# Altium schematic sheet Controller2.SchDoc
size A3
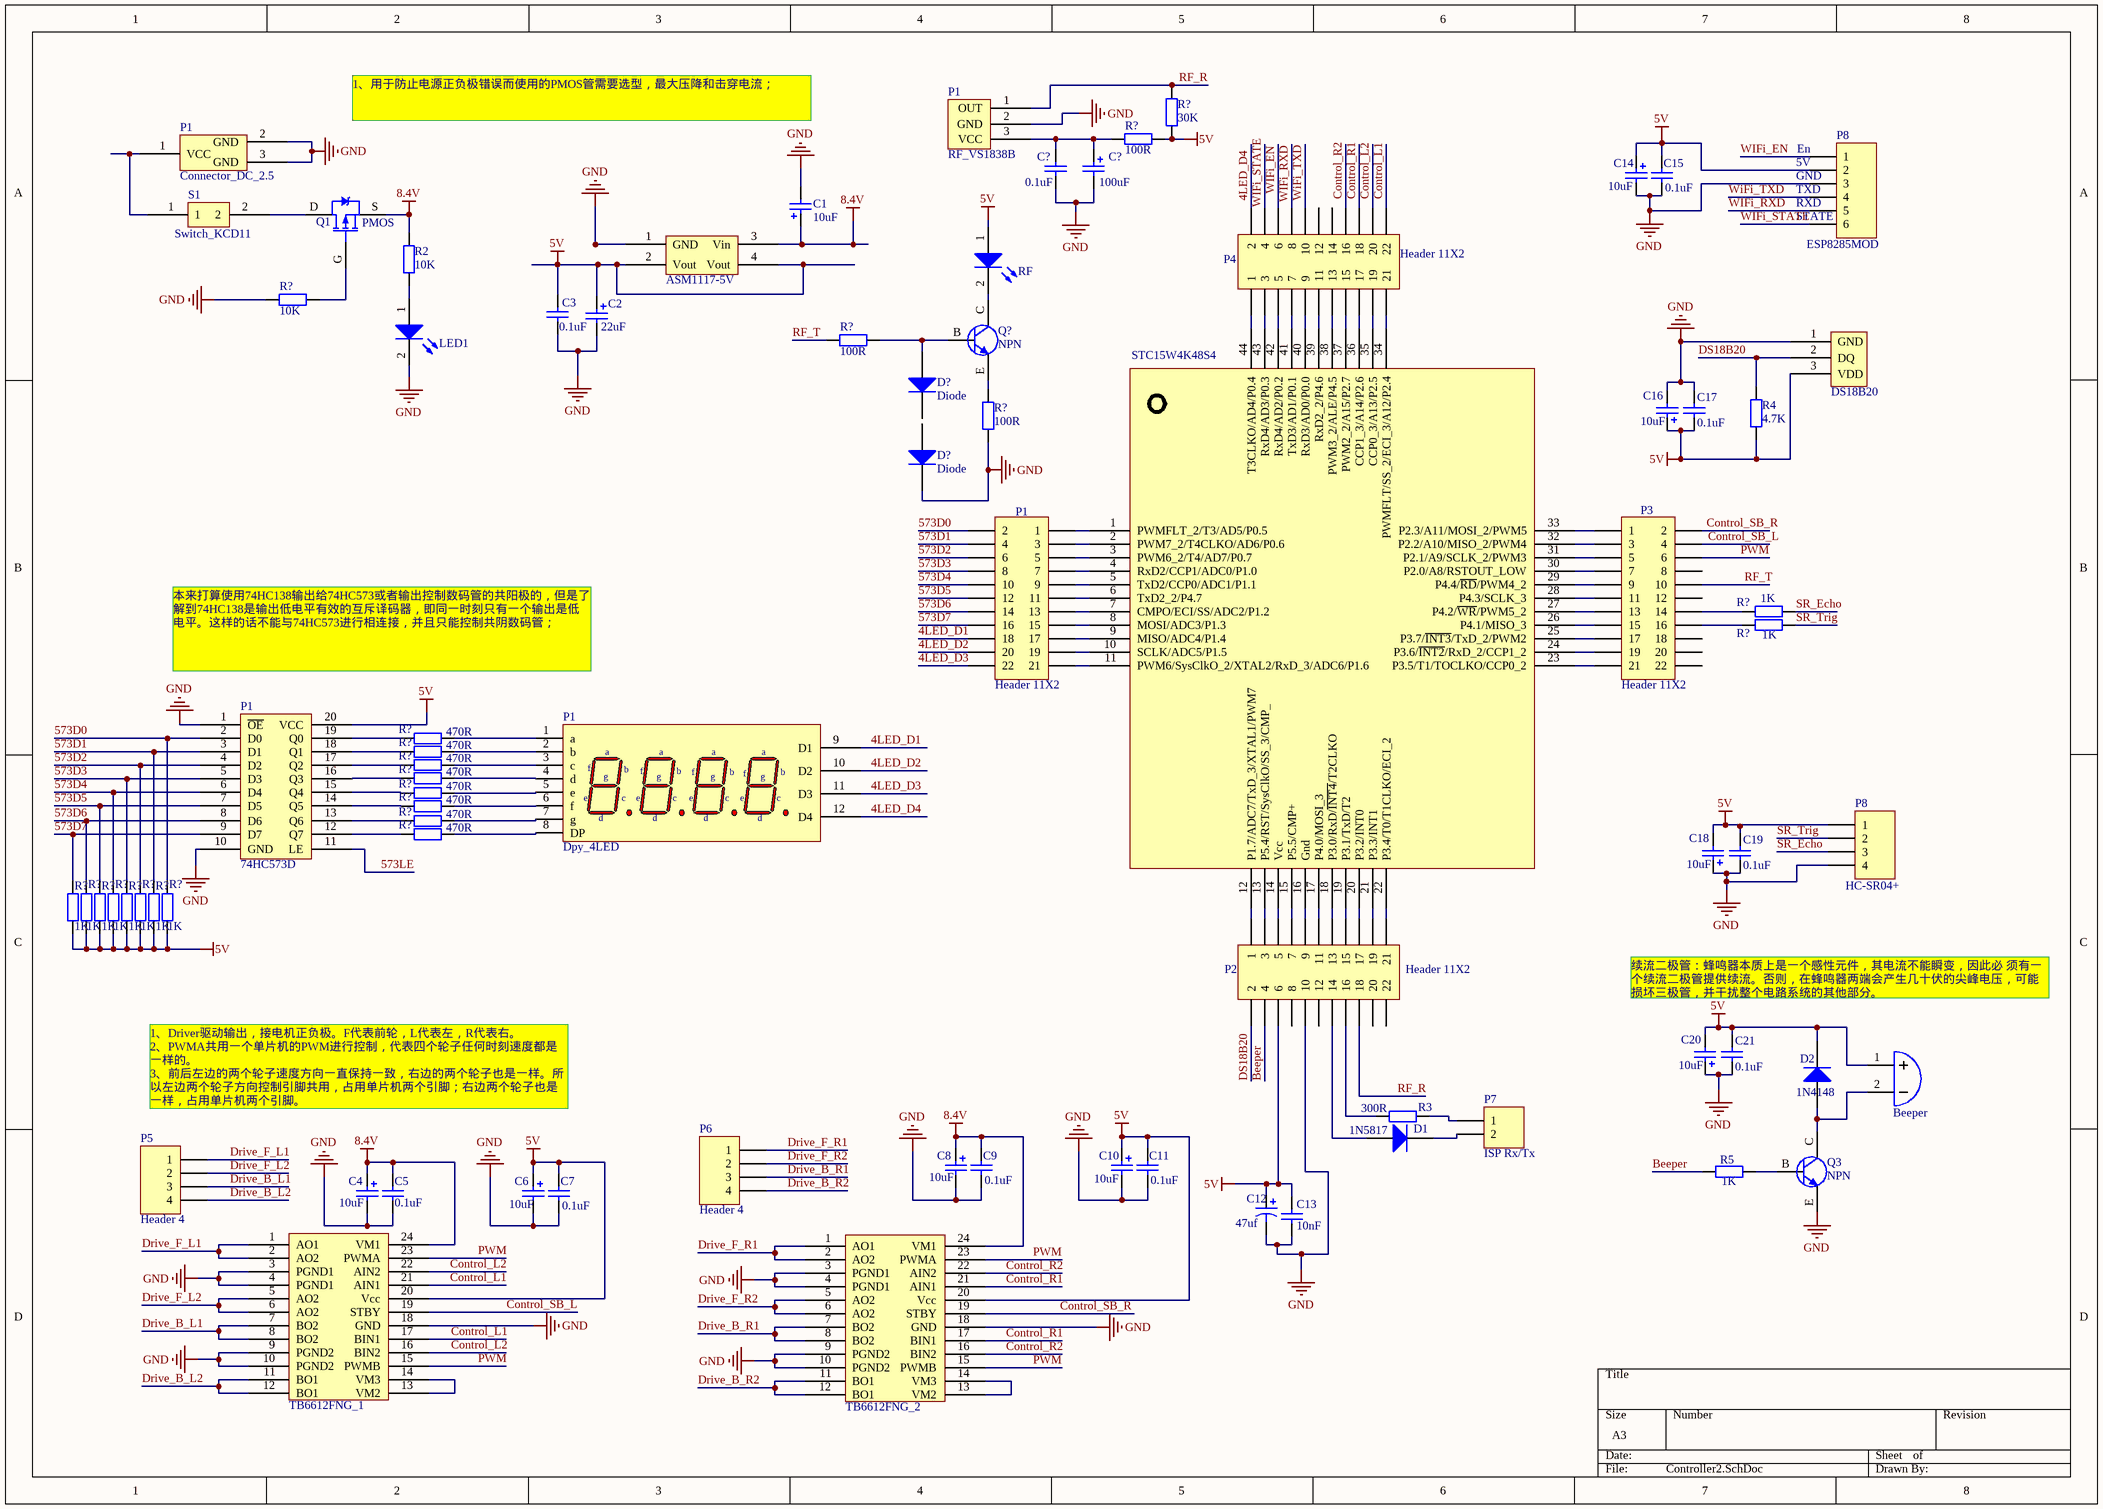
[diagram p0: Controller2.SchDoc]

## Parts
(Parts that share a designator on the sheet are numbered #1, #2 ... from top to bottom, then left to right.)
*  STC15W4K48S4  [STC15W4K48S4_LQFP44]
ASM1117-5V  ASM1117-5V  [SOT-223]  (value not drawn)
Beeper  Beeper  [Buzzer-2Pins]  (value not drawn)
C1  value 10uF  [C1206-Pole]  (hidden comment: Cap_Pole)
C2  value 22uF  [C1206-Pole]  (hidden comment: Cap_Pole)
C3  value 0.1uF  [C0603]  (hidden comment: Cap)
C4  10uF  [C1206-Pole]
C5  0.1uF  [C0603]
C6  10uF  [C1206-Pole]
C7  0.1uF  [C0603]
C8  10uF  [C1206-Pole]
C9  0.1uF  [C0603]
C10  10uF  [C1206-Pole]
C11  0.1uF  [C0603]
C12  value 47uf  [RB7.6-15]  (hidden comment: Cap Pol1)
C13  value 10nF  [RAD-0.3]  (hidden comment: Cap)
C14  10uF  [C1206-Pole]
C15  0.1uF  [C0603]
C16  10uF  [C1206-Pole]
C17  0.1uF  [C0603]
C18  10uF  [C1206-Pole]
C19  0.1uF  [C0603]
C20  10uF  [C1206-Pole]
C21  0.1uF  [C0603]
C?#1  value 0.1uF  [C0603]  (hidden comment: Cap)
C?#2  value 100uF  [C1206-Pole]  (hidden comment: Cap_Pole)
D1  1N5817  [DO-35]
D2  1N4148  [SMA/DO-214AC]
D?#1  Diode  [SMA/DO-214AC]
D?#2  Diode  [SMA/DO-214AC]
DS18B20  DS18B20  [TO-92]  (value not drawn)
LED1  LED-0805  [LED-0805]  (value not drawn)
P1#1  RF_VS1838B  [RF_VS1838B]
P1#2  Connector_DC_2.5  [Connector_DC_2.5]
P1#3  Header 11X2  [HDR2X11]
P1#4  74HC573D  [74HC573D_SOP]
P1#5  Dpy_4LED  [Dpy_LED4_Power]
P2  Header 11X2  [HDR2X11]
P3  Header 11X2  [HDR2X11]
P4  Header 11X2  [HDR2X11]
P5  Header 4  [HDR1X4]
P6  Header 4  [HDR1X4]
P7  ISP Rx/Tx  [HDR1X2]
P8#1  ESP8285MOD  [HDR1X6]
P8#2  HC-SR04+  [HDR1X4]
Q1  PMOS  [SOT-23/MOS]
Q3  NPN  [SOT-23/transistor]
Q?  NPN  [SOT-23/transistor]
R2  10K  [R0603]
R3  value 300R  [AXIAL-0.4]  (hidden comment: Res2)
R4  4.7K  [R0603]
R5  1K  [R0603]
R?#1  100R  [R0603]
R?#2  30K  [R0603]
R?#3  10K  [R0603]
R?#4  100R  [R0603]
R?#5  100R  [R0603]
R?#6  1K  [R0603]
R?#7  1K  [R0603]
R?#8  470R  [R0603]
R?#9  470R  [R0603]
R?#10  470R  [R0603]
R?#11  470R  [R0603]
R?#12  470R  [R0603]
R?#13  470R  [R0603]
R?#14  470R  [R0603]
R?#15  470R  [R0603]
R?#16  1K  [R0603]
R?#17  1K  [R0603]
R?#18  1K  [R0603]
R?#19  1K  [R0603]
R?#20  1K  [R0603]
R?#21  1K  [R0603]
R?#22  1K  [R0603]
R?#23  1K  [R0603]
RF  LED-0805  [LED-0805]  (value not drawn)
S1  Switch_KCD11  [Switch_KCD11]
TB6612FNG_1  TB6612FNG  [ssop24]  (value not drawn)
TB6612FNG_2  TB6612FNG  [ssop24]  (value not drawn)

## Nets
5V: ASM1117-5V.2(Vout) ASM1117-5V.4(Vout) Beeper.1(A) C2.1 C3.1 C6.1 C7.1 C10.1 C11.1 C12.1 C13.2 C16.1 C17.2 C18.2 C19.1 C20.2 C21.1 D2.2 DS18B20.3(VDD) P1#4.20(VCC) P2.6 P8#2.1 R4.1 R?#1.1 R?#2.2 R?#16.1 R?#17.1 R?#18.1 R?#19.1 R?#20.1 R?#21.1 R?#22.1 R?#23.1 RF.1(A) TB6612FNG_1.20(Vcc) TB6612FNG_2.20(Vcc)
8.4V: ASM1117-5V.3(Vin) C1.1 C4.1 C5.1 C8.1 C9.1 Q1.S R2.1 TB6612FNG_1.24(VM1) TB6612FNG_2.24(VM1)
GND: ASM1117-5V.1(GND) C1.2 C2.2 C3.2 C4.2 C5.2 C6.2 C7.2 C8.2 C9.2 C10.2 C11.2 C12.2 C13.1 C14.2 C15.2 C16.2 C17.1 C18.1 C19.2 C20.1 C21.2 C?#1.2 C?#2.2 D?#2.2 DS18B20.1(GND) LED1.2(K) P1#1.2(GND) P1#2.2(GND) P1#2.3(GND) P1#4.1(~{OE}) P1#4.10(GND) P2.10 P8#1.3 P8#2.4 Q3.E R?#3.1 R?#5.2 TB6612FNG_1.3(PGND1) TB6612FNG_1.4(PGND1) TB6612FNG_1.9(PGND2) TB6612FNG_1.10(PGND2) TB6612FNG_1.18(GND) TB6612FNG_2.3(PGND1) TB6612FNG_2.4(PGND1) TB6612FNG_2.9(PGND2) TB6612FNG_2.10(PGND2) TB6612FNG_2.18(GND)
4LED_D1: P1#3.18 P1#5.9(D1)
4LED_D2: P1#3.20 P1#5.10(D2)
4LED_D3: P1#3.22 P1#5.11(D3)
4LED_D4: P1#5.12(D4) P4.2
573D0: P1#3.2 P1#4.2(D0) R?#23.2
573D1: P1#3.4 P1#4.3(D1) R?#22.2
573D2: P1#3.6 P1#4.4(D2) R?#21.2
573D3: P1#3.8 P1#4.5(D3) R?#20.2
573D4: P1#3.10 P1#4.6(D4) R?#19.2
573D5: P1#3.12 P1#4.7(D5) R?#18.2
573D6: P1#3.14 P1#4.8(D6) R?#17.2
573D7: P1#3.16 P1#4.9(D7) R?#16.2
573LE: P1#4.11(LE)
Beeper: P2.4 R5.1
Control_L1: P4.22 TB6612FNG_1.17(BIN1) TB6612FNG_1.21(AIN1)
Control_L2: P4.20 TB6612FNG_1.16(BIN2) TB6612FNG_1.22(AIN2)
Control_R1: P4.18 TB6612FNG_2.17(BIN1) TB6612FNG_2.21(AIN1)
Control_R2: P4.16 TB6612FNG_2.16(BIN2) TB6612FNG_2.22(AIN2)
Control_SB_L: P3.4 TB6612FNG_1.19(STBY)
Control_SB_R: P3.2 TB6612FNG_2.19(STBY)
Drive_B_L1: P5.3 TB6612FNG_1.7(BO2) TB6612FNG_1.8(BO2)
Drive_B_L2: P5.4 TB6612FNG_1.11(BO1) TB6612FNG_1.12(BO1)
Drive_B_R1: P6.3 TB6612FNG_2.7(BO2) TB6612FNG_2.8(BO2)
Drive_B_R2: P6.4 TB6612FNG_2.11(BO1) TB6612FNG_2.12(BO1)
Drive_F_L1: P5.1 TB6612FNG_1.1(AO1) TB6612FNG_1.2(AO2)
Drive_F_L2: P5.2 TB6612FNG_1.5(AO2) TB6612FNG_1.6(AO2)
Drive_F_R1: P6.1 TB6612FNG_2.1(AO1) TB6612FNG_2.2(AO2)
Drive_F_R2: P6.2 TB6612FNG_2.5(AO2) TB6612FNG_2.6(AO2)
DS18B20: DS18B20.2(DQ) P2.2 R4.2
PWM: P3.6 TB6612FNG_1.15(PWMB) TB6612FNG_1.23(PWMA) TB6612FNG_2.15(PWMB) TB6612FNG_2.23(PWMA)
RF_R: P1#1.1(OUT) P2.18 R?#2.1
RF_T: P3.10 R?#4.2
SR_Echo: P8#2.3 R?#6.2
SR_Trig: P8#2.2 R?#7.2
WIFi_EN: P4.6 P8#1.1
WIFi_RXD: P4.8 P8#1.5
WIFi_STATE: P4.4 P8#1.6
WiFi_TXD: P4.10 P8#1.4
Net*_1: *.1(PWMFLT_2/T3/AD5/P0.5) P1#3.1
Net*_2: *.2(PWM7_2/T4CLKO/AD6/P0.6) P1#3.3
Net*_3: *.3(PWM6_2/T4/AD7/P0.7) P1#3.5
Net*_4: *.4(RxD2/CCP1/ADC0/P1.0) P1#3.7
Net*_5: *.5(TxD2/CCP0/ADC1/P1.1) P1#3.9
Net*_6: *.6(TxD2_2/P4.7) P1#3.11
Net*_7: *.7(CMPO/ECI/SS/ADC2/P1.2) P1#3.13
Net*_8: *.8(MOSI/ADC3/P1.3) P1#3.15
Net*_9: *.9(MISO/ADC4/P1.4) P1#3.17
Net*_10: *.10(SCLK/ADC5/P1.5) P1#3.19
Net*_11: *.11(PWM6/SysClkO_2/XTAL2/RxD_3/ADC6/P1.6) P1#3.21
Net*_12: *.12(P1.7/ADC7/TxD_3/XTAL1/PWM7) P2.1
Net*_13: *.13(P5.4/RST/SysClkO/SS_3/CMP_) P2.3
Net*_14: *.14(Vcc) P2.5
Net*_15: *.15(P5.5/CMP+) P2.7
Net*_16: *.16(Gnd) P2.9
Net*_17: *.17(P4.0/MOSI_3) P2.11
Net*_18: *.18(P3.0/RxD/~{INT4}/T2CLKO) P2.13
Net*_19: *.19(P3.1/TxD/T2) P2.15
Net*_20: *.20(P3.2/INT0) P2.17
Net*_21: *.21(P3.3/INT1) P2.19
Net*_22: *.22(P3.4/T0/T1CLKO/ECI_2) P2.21
Net*_23: *.23(P3.5/T1/TOCLKO/CCP0_2) P3.21
Net*_24: *.24(P3.6/~{INT2}/RxD_2/CCP1_2) P3.19
Net*_25: *.25(P3.7/~{INT3}/TxD_2/PWM2) P3.17
Net*_26: *.26(P4.1/MISO_3) P3.15
Net*_27: *.27(P4.2/~{WR}/PWM5_2) P3.13
Net*_28: *.28(P4.3/SCLK_3) P3.11
Net*_29: *.29(P4.4/~{RD}/PWM4_2) P3.9
Net*_30: *.30(P2.0/A8/RSTOUT_LOW) P3.7
Net*_31: *.31(P2.1/A9/SCLK_2/PWM3) P3.5
Net*_32: *.32(P2.2/A10/MISO_2/PWM4) P3.3
Net*_33: *.33(P2.3/A11/MOSI_2/PWM5) P3.1
Net*_34: *.34(PWMFLT/SS_2/ECI_3/A12/P2.4) P4.21
Net*_35: *.35(CCP0_3/A13/P2.5) P4.19
Net*_36: *.36(CCP1_3/A14/P2.6) P4.17
Net*_37: *.37(PWM2_2/A15/P2.7) P4.15
Net*_38: *.38(PWM3_2/ALE/P4.5) P4.13
Net*_39: *.39(RxD2_2/P4.6) P4.11
Net*_40: *.40(RxD3/AD0/P0.0) P4.9
Net*_41: *.41(TxD3/AD1/P0.1) P4.7
Net*_42: *.42(RxD4/AD2/P0.2) P4.5
Net*_43: *.43(RxD4/AD3/P0.3) P4.3
Net*_44: *.44(T3CLKO/AD4/P0.4) P4.1
NetBeeper_2: Beeper.2(B) D2.1 Q3.C
NetC14_1: C14.1 C15.1 P8#1.2
NetC?#1_1: C?#1.1 C?#2.1 P1#1.3(VCC) R?#1.2
NetD1_1: D1.1(A) P2.14
NetD1_2: D1.2(K) P7.2
NetD?#1_1: D?#1.1 Q?.B R?#4.1
NetLED1_1: LED1.1(A) R2.2
NetP1#2_1: P1#2.1(VCC) S1.1
NetP1#4_12: P1#4.12(Q7) R?#15.1
NetP1#4_13: P1#4.13(Q6) R?#14.1
NetP1#4_14: P1#4.14(Q5) R?#13.1
NetP1#4_15: P1#4.15(Q4) R?#12.1
NetP1#4_16: P1#4.16(Q3) R?#11.1
NetP1#4_17: P1#4.17(Q2) R?#10.1
NetP1#4_18: P1#4.18(Q1) R?#9.1
NetP1#4_19: P1#4.19(Q0) R?#8.1
NetP1#5_1: P1#5.1(a) R?#8.2
NetP1#5_2: P1#5.2(b) R?#9.2
NetP1#5_3: P1#5.3(c) R?#10.2
NetP1#5_4: P1#5.4(d) R?#11.2
NetP1#5_5: P1#5.5(e) R?#12.2
NetP1#5_6: P1#5.6(f) R?#13.2
NetP1#5_7: P1#5.7(g) R?#14.2
NetP1#5_8: P1#5.8(DP) R?#15.2
NetP2_16: P2.16 R3.1
NetP3_14: P3.14 R?#6.1
NetP3_16: P3.16 R?#7.1
NetP7_1: P7.1 R3.2
NetQ1_D: Q1.D S1.2
NetQ1_G: Q1.G R?#3.2
NetQ3_B: Q3.B R5.2
NetQ?_C: Q?.C RF.2(K)
NetQ?_E: Q?.E R?#5.1
NetTB6612FNG_1_13: TB6612FNG_1.13(VM2) TB6612FNG_1.14(VM3)
NetTB6612FNG_2_13: TB6612FNG_2.13(VM2) TB6612FNG_2.14(VM3)

Not connected (* = marked no-connect by the designer): D?#1 2; D?#2 1; P2 8 12 20 22; P3 8 12 18 20 22; P4 12 14

## Notes on the sheet
- 1、用于防止电源正负极错误而使用的PMOS管需要选型，最大压降和击穿电流；
- (near P8#1) 5V
- (near P8#1) GND
- (near P8#1) En
- (near P8#1) TXD
- (near P8#1) RXD
- (near P8#1) STATE
- 本来打算使用74HC138输出给74HC573或者输出控制数码管的共阳极的，但是了解到74HC138是输出低电平有效的互斥译码器，即同一时刻只有一个输出是低电平。这样的话不能与74HC573进行相连接，并且只能控制共阴数码管；
- 续流二极管：蜂鸣器本质上是一个感性元件，其电流不能瞬变，因此必 须有一个续流二极管提供续流。否则，在蜂鸣器两端会产生几十伏的尖峰电压，可能损坏三极管，并干扰整个电路系统的其他部分。
- 1、Driver驱动输出，接电机正负极。F代表前轮，L代表左，R代表右。
  2、PWMA共用一个单片机的PWM进行控制，代表四个轮子任何时刻速度都是一样的。
  3、前后左边的两个轮子速度方向一直保持一致，右边的两个轮子也是一样。所以左边两个轮子方向控制引脚共用，占用单片机两个引脚；右边两个轮子也是一样，占用单片机两个引脚。
- Labels drawn without touching a wire or pin: 5V

## Library data of the parts
* = STC15W4K48S4_LQFP44
C1 C2 C4 C6 C8 C10 C14 C16 C18 C20 C?#2 = Cap_Pole: cap with pole
  C4 C6 C8 C10 C14 C16 C18 C20: value: 10uF
C3 C5 C7 C9 C11 C15 C17 C19 C21 C?#1 = Cap: cap without pole
C12 = Cap Pol1: Polarized Capacitor (Radial); Published: 8-Jun-2000; LatestRevisionDate: 17-Jul-2002; LatestRevisionNote: Re-released for DXP Platform.; PackageReference: RB7.6-15; Publisher: Altium Limited; PackageDescription: Polarized Capacitor (Radial); 2 Leads
C13 = Cap: Capacitor; Published: 8-Jun-2000; LatestRevisionDate: 17-Jul-2002; LatestRevisionNote: Re-released for DXP Platform.; PackageReference: RAD-0.3; Publisher: Altium Limited; PackageDescription: Radial Cap, Thru-Hole; 2 Leads; 0.3 in Pin Spacing
D1 = Diode 1N914: High Conductance Fast Diode; Published: 8-Jun-2000; LatestRevisionDate: 17-Jul-2002; LatestRevisionNote: Re-released for DXP Platform.; DatasheetVersion: 1997; PackageReference: DO-35; Publisher: Altium Limited; PackageDescription: Diode, Axial; Body 3.8 x 1.9 mm (LxDia. max), Lead Dia. 0.53 mm (max); Code_JEDEC: DO-204-AH; ComponentLink1Description: Manufacturer Link; ComponentLink1URL: http://www.fairchildsemi.com/; ComponentLink2Description: Datasheet; ComponentLink2URL: http://www.fairchildsemi.com/ds/1N%2F1N4448.pdf
D2 = Diode
LED1 RF = LED
P1#3 P2-P4 = Header 11X2: Header, 11-Pin, Dual row; LatestRevisionDate: 17-Jul-2002; LatestRevisionNote: Re-released for DXP Platform.; Publisher: Altium Limited
P5 P6 P8#2 = Header 4: Header, 4-Pin; LatestRevisionDate: 17-Jul-2002; LatestRevisionNote: Re-released for DXP Platform.; Publisher: Altium Limited
P7 = Header 2: Header, 2-Pin; LatestRevisionDate: 17-Jul-2002; LatestRevisionNote: Re-released for DXP Platform.; Publisher: Altium Limited
P8#1 = Header 6: Header, 6-Pin; LatestRevisionDate: 17-Jul-2002; LatestRevisionNote: Re-released for DXP Platform.; Publisher: Altium Limited
R2 R4 R5 R?#1-R?#23 = Res: Resister
R3 = Res2: Resistor; Published: 8-Jun-2000; LatestRevisionDate: 17-Jul-2002; LatestRevisionNote: Re-released for DXP Platform.; PackageReference: AXIAL-0.4; Publisher: Altium Limited; PackageDescription: Axial Device, Thru-Hole; 2 Leads; 0.4 in Pin Spacing